# Altium schematic sheet KA2_2.SchDoc
size 420 x 297 mm; SheetNumber: 2; SheetTotal: 6
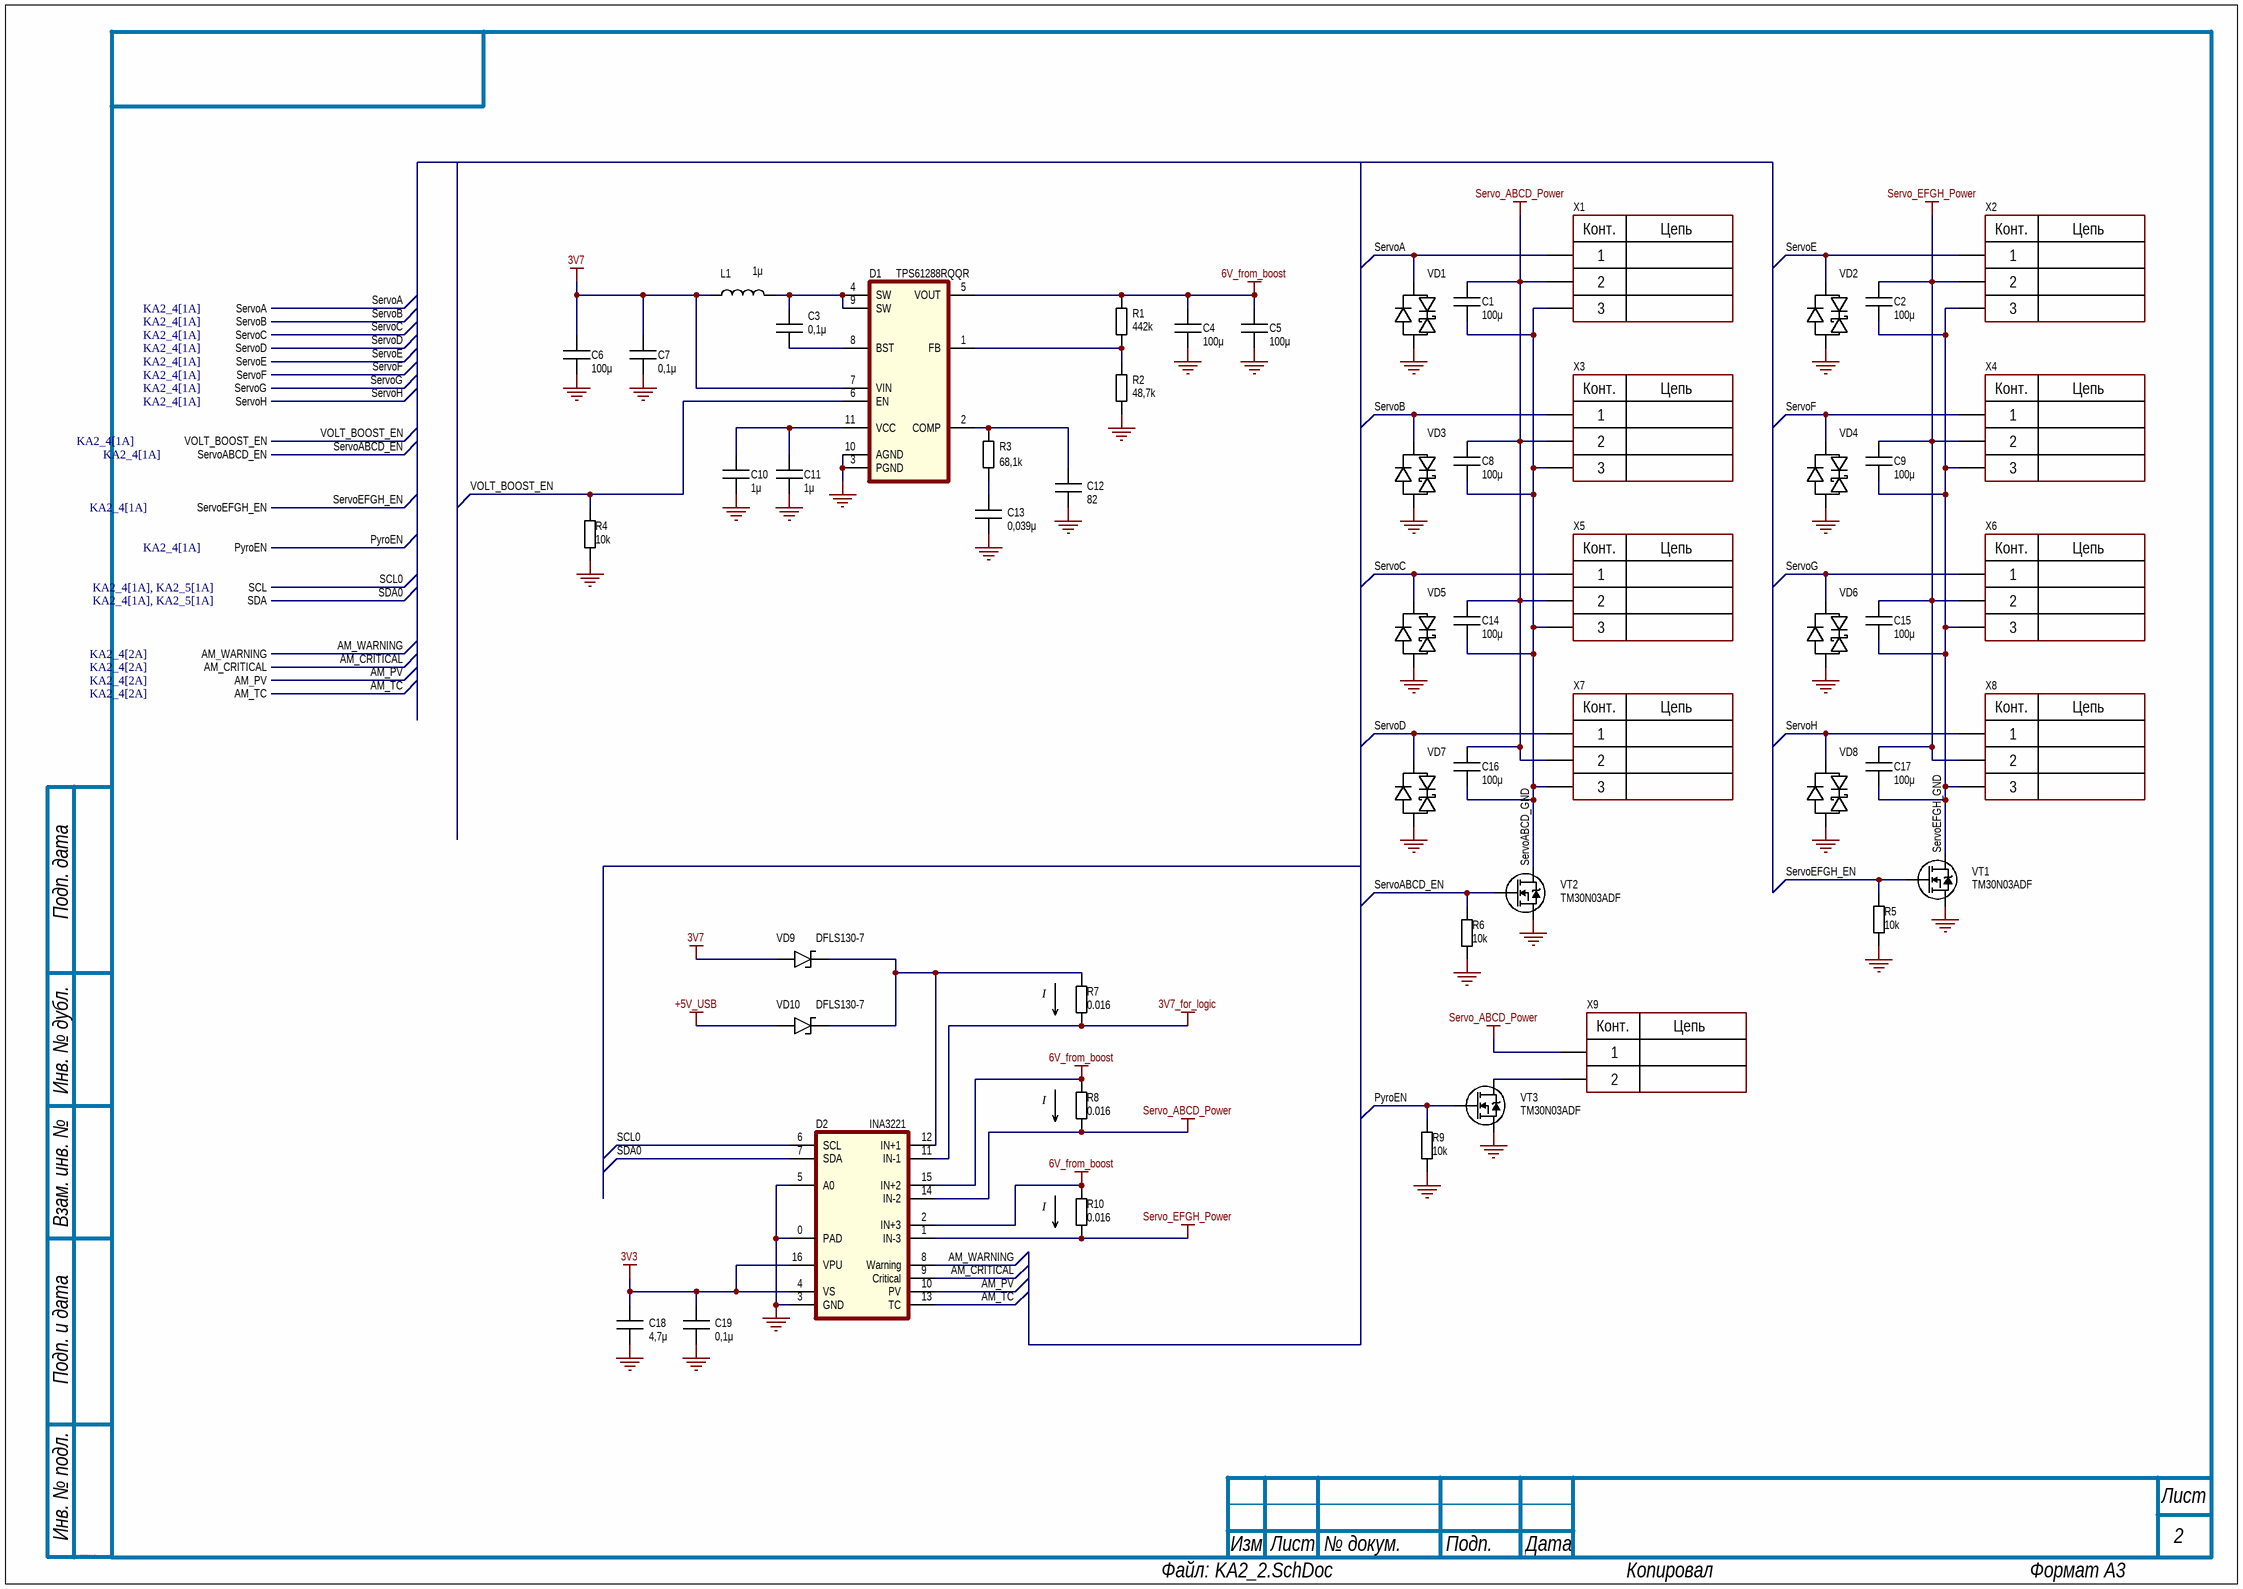
[diagram p0: KA2_2.SchDoc]

## Parts
C1  value 100μ  [Capacitor_1206]
C2  value 100μ  [Capacitor_1206]
C3  value 0,1μ  [Capacitor_0402]
C4  value 100μ  [Capacitor_1206]
C5  value 100μ  [Capacitor_1206]
C6  value 100μ  [Capacitor_1206]
C7  value 0,1μ  [Capacitor_0402]
C8  value 100μ  [Capacitor_1206]
C9  value 100μ  [Capacitor_1206]
C10  value 1μ  [Capacitor_0402]
C11  value 1μ  [Capacitor_0402]
C12  value 82  [Capacitor_0402]
C13  value 0,039μ  [Capacitor_0402]
C14  value 100μ  [Capacitor_1206]
C15  value 100μ  [Capacitor_1206]
C16  value 100μ  [Capacitor_1206]
C17  value 100μ  [Capacitor_1206]
C18  value 4,7μ  [Capacitor_0402]
C19  value 0,1μ  [Capacitor_0402]
D1  value TPS61288RQQR  [TPS61288]  (hidden comment: Boost Switching Regulator IC Adjustable 4.5V~18V 1 Output 15A VQFN-11-HR(2.5x3))
D2  INA3221  [QFN16_4x4mm]
L1  value 1μ  [Inductor_AWLU0730F-1R0MGA]  (hidden comment: 12A 1uH ±20% 7.4mΩ 15A Molded Inductor SMD,7x6.6mm Fixed Inductors RoHS)
R1  value 442k  [RES: 0402]
R2  value 48,7k  [RES: 0402]
R3  value 68,1k  [RES: 0402]
R4  value 10k  [RES: 0402]
R5  value 10k  [RES: 0402]
R6  value 10k  [RES: 0402]
R7  value 0.016  [RES: 1206]
R8  value 0.016  [RES: 1206]
R9  value 10k  [RES: 0402]
R10  value 0.016  [RES: 1206]
VD1  D1213A-01T  [SOD-523]  (value not drawn)
VD2  D1213A-01T  [SOD-523]  (value not drawn)
VD3  D1213A-01T  [SOD-523]  (value not drawn)
VD4  D1213A-01T  [SOD-523]  (value not drawn)
VD5  D1213A-01T  [SOD-523]  (value not drawn)
VD6  D1213A-01T  [SOD-523]  (value not drawn)
VD7  D1213A-01T  [SOD-523]  (value not drawn)
VD8  D1213A-01T  [SOD-523]  (value not drawn)
VD9  value DFLS130-7  [PowerDI-123]  (hidden comment: 1 Independent 30V 420mV@1A 1A PowerDI-123 Single Diodes RoHS)
VD10  value DFLS130-7  [PowerDI-123]  (hidden comment: 1 Independent 30V 420mV@1A 1A PowerDI-123 Single Diodes RoHS)
VT1  TM30N03ADF  [TM30N03ADF]
VT2  TM30N03ADF  [TM30N03ADF]
VT3  TM30N03ADF  [TM30N03ADF]
X1  Connector_JST_XH_B3B-XH-A_1x03_2.50mm  [CONN_JST_XH_B3B-XH-A_1x03_P2.50mm]  (value not drawn)  (no BOM)
X2  Connector_JST_XH_B3B-XH-A_1x03_2.50mm  [CONN_JST_XH_B3B-XH-A_1x03_P2.50mm]  (value not drawn)  (no BOM)
X3  Connector_JST_XH_B3B-XH-A_1x03_2.50mm  [CONN_JST_XH_B3B-XH-A_1x03_P2.50mm]  (value not drawn)  (no BOM)
X4  Connector_JST_XH_B3B-XH-A_1x03_2.50mm  [CONN_JST_XH_B3B-XH-A_1x03_P2.50mm]  (value not drawn)  (no BOM)
X5  Connector_JST_XH_B3B-XH-A_1x03_2.50mm  [CONN_JST_XH_B3B-XH-A_1x03_P2.50mm]  (value not drawn)  (no BOM)
X6  Connector_JST_XH_B3B-XH-A_1x03_2.50mm  [CONN_JST_XH_B3B-XH-A_1x03_P2.50mm]  (value not drawn)  (no BOM)
X7  Connector_JST_XH_B3B-XH-A_1x03_2.50mm  [CONN_JST_XH_B3B-XH-A_1x03_P2.50mm]  (value not drawn)  (no BOM)
X8  Connector_JST_XH_B3B-XH-A_1x03_2.50mm  [CONN_JST_XH_B3B-XH-A_1x03_P2.50mm]  (value not drawn)  (no BOM)
X9  Connector_JST_XH_B2B-XH-A_1x02_2.50mm  [CONN_JST_XH_B2B-XH-A_1x02_P2.50mm]  (value not drawn)  (no BOM)

## Ports
AM_CRITICAL (see KA2_4[2A]), AM_PV (see KA2_4[2A]), AM_TC (see KA2_4[2A]), AM_WARNING (see KA2_4[2A]), PyroEN (see KA2_4[1A]), SCL (see KA2_4[1A], KA2_5[1A]), SDA (see KA2_4[1A], KA2_5[1A]), ServoA (see KA2_4[1A]), ServoABCD_EN (see KA2_4[1A]), ServoB (see KA2_4[1A]), ServoC (see KA2_4[1A]), ServoD (see KA2_4[1A]), ServoE (see KA2_4[1A]), ServoEFGH_EN (see KA2_4[1A]), ServoF (see KA2_4[1A]), ServoG (see KA2_4[1A]), ServoH (see KA2_4[1A]), VOLT_BOOST_EN (see KA2_4[1A])

## Nets
3V3: C18.2 C19.2 D2.4(VS) D2.16(VPU)
3V7: C6.2 C7.2 D1.7(VIN) L1.2 VD9.A(Anode)
3V7_for_logic: D2.11(IN-1) R7.1
6V_from_boost: C4.2 C5.2 D1.5(VOUT) D2.2(IN+3) D2.15(IN+2) R1.2 R8.2 R10.2
+5V_USB: VD10.A(Anode)
GND: C4.1 C5.1 C6.1 C7.1 C10.1 C11.1 C12.1 C13.1 C18.1 C19.1 D1.3(PGND) D1.10(AGND) D2.0(PAD) D2.3(GND) D2.5(A0) R2.1 R4.1 R5.1 R6.1 R9.1 VD1.A VD2.A VD3.A VD4.A VD5.A VD6.A VD7.A VD8.A VT1.S VT2.S VT3.S
Servo_ABCD_Power: C1.2 C8.2 C14.2 C16.2 D2.14(IN-2) R8.1 X1.2 X3.2 X5.2 X7.2 X9.1
Servo_EFGH_Power: C2.2 C9.2 C15.2 C17.2 D2.1(IN-3) R10.1 X2.2 X4.2 X6.2 X8.2
AM_CRITICAL: D2.9(Critical) ; port AM_CRITICAL
AM_PV: D2.10(PV) ; port AM_PV
AM_TC: D2.13(TC) ; port AM_TC
AM_WARNING: D2.8(Warning) ; port AM_WARNING
PyroEN: R9.2 VT3.G ; port PyroEN
SCL0: D2.6(SCL) ; port SCL
SDA0: D2.7(SDA) ; port SDA
ServoA: VD1.K X1.1 ; port ServoA
ServoABCD_EN: R6.2 VT2.G ; port ServoABCD_EN
ServoABCD_GND: C1.1 C8.1 C14.1 C16.1 VT2.D X1.3 X3.3 X5.3 X7.3
ServoB: VD3.K X3.1 ; port ServoB
ServoC: VD5.K X5.1 ; port ServoC
ServoD: VD7.K X7.1 ; port ServoD
ServoE: VD2.K X2.1 ; port ServoE
ServoEFGH_EN: R5.2 VT1.G ; port ServoEFGH_EN
ServoEFGH_GND: C2.1 C9.1 C15.1 C17.1 VT1.D X2.3 X4.3 X6.3 X8.3
ServoF: VD4.K X4.1 ; port ServoF
ServoG: VD6.K X6.1 ; port ServoG
ServoH: VD8.K X8.1 ; port ServoH
VOLT_BOOST_EN: D1.6(EN) R4.2 ; port VOLT_BOOST_EN
NetC3_1: C3.1 D1.8(BST)
NetC3_2: C3.2 D1.4(SW) D1.9(SW) L1.1
NetC10_2: C10.2 C11.2 D1.11(VCC)
NetC12_2: C12.2 D1.2(COMP) R3.2
NetC13_2: C13.2 R3.1
NetD1_1: D1.1(FB) R1.1 R2.2
NetD2_12: D2.12(IN+1) R7.2 VD9.K(Kathode) VD10.K(Kathode)
NetVT3_D: VT3.D X9.2

## Notes on the sheet
- (near R7) I
- (near R8) I
- (near R10) I
- Подп. дата
- Инв. № дубл.
- Взам. инв. №
- Подп. и дата
- Инв. № подл.
- Изм.
- Лист
- № докум.
- Подп.
- Дата
- ALTIUM GOSTBOM2.0 KEV
- Файл:
- Копировал
- Формат А3
- (in symbol Connector_JST_XH_B2B-XH-A_1x02_2.50mm) Конт.; Цепь
- (in symbol Connector_JST_XH_B3B-XH-A_1x03_2.50mm) Конт.; Цепь

## Library data of the parts
C1 C2 C4-C6 C8 C9 C14-C17 = Ceramic_1206: ValueManufacturerPartNumber: Ceramic capacitor, 100μ, X7R, ±10%, 50V, 1206; TypeCapacitor: Ceramic capacitor; Tolerance: ±10%; TypeDielectric: X7R; Voltage: 50V; Manufacturer: *; HelpURL: *; Package: 1206; Mfr.Part: *
C3 C7 C19 = Ceramic_0402: ValueManufacturerPartNumber: Ceramic capacitor, 0,1μ, X7R, ±10%, 16V, 0402; TypeCapacitor: Ceramic capacitor; Tolerance: ±10%; TypeDielectric: X7R; Voltage: 16V; Manufacturer: *; HelpURL: *; Package: 0402; Mfr.Part: *
C10 C11 = Ceramic_0402: ValueManufacturerPartNumber: Ceramic capacitor, 1μ, X7R, ±10%, 16V, 0402; TypeCapacitor: Ceramic capacitor; Tolerance: ±10%; TypeDielectric: X7R; Voltage: 16V; Manufacturer: *; HelpURL: *; Package: 0402; Mfr.Part: *
C12 = Ceramic_0402: ValueManufacturerPartNumber: Ceramic capacitor, 82, X7R, ±10%, 16V, 0402; TypeCapacitor: Ceramic capacitor; Tolerance: ±10%; TypeDielectric: X7R; Voltage: 16V; Manufacturer: *; HelpURL: *; Package: 0402; Mfr.Part: *
C13 = Ceramic_0402: ValueManufacturerPartNumber: Ceramic capacitor, 0,039μ, X7R, ±10%, 16V, 0402; TypeCapacitor: Ceramic capacitor; Tolerance: ±10%; TypeDielectric: X7R; Voltage: 16V; Manufacturer: *; HelpURL: *; Package: 0402; Mfr.Part: *
C18 = Ceramic_0402: ValueManufacturerPartNumber: Ceramic capacitor, 4,7μ, X7R, ±10%, 16V, 0402; TypeCapacitor: Ceramic capacitor; Tolerance: ±10%; TypeDielectric: X7R; Voltage: 16V; Manufacturer: *; HelpURL: *; Package: 0402; Mfr.Part: *
D1 = TPS61288RQQR: Manufacturer: Texas Instruments; Mfr.Part: TPS61288RQQR; HelpURL: https://www.lcsc.com/product-image/C5219223.html
D2 = INA3221: Микросхема трехканального амперметра-вольтметра; Manufacturer: Texas Instruments; Mfr.Part: INA3221AIRGVR; Value: INA3221; HelpURL: https://www.lcsc.com/product-detail/C181255.html
L1 = Inductor_AWLU0730F-1R0MGA: 17A 1uH ±20% 3.8mΩ 21A Molded Inductor SMD,7.2x7mm Fixed Inductors RoHS; Manufacturer: APV; Mfr.Part: AWLU0730F-1R0MGA; HelpURL: https://www.lcsc.com/product-detail/C54123597.html
R1 = Resistor_0402: ValueManufacturerPartNumber: Resistor, 442k, ±1%, 0402; Tolerance: ±1%; Manufacturer: *; Package: 0402; Mfr.Part: *; TypeResistor: Resistor; HelpURL: *
R2 = Resistor_0402: ValueManufacturerPartNumber: Resistor, 48,7k, ±1%, 0402; Tolerance: ±1%; Manufacturer: *; Package: 0402; Mfr.Part: *; TypeResistor: Resistor; HelpURL: *
R3 = Resistor_0402: ValueManufacturerPartNumber: Resistor, 68,1k, ±1%, 0402; Tolerance: ±1%; Manufacturer: *; Package: 0402; Mfr.Part: *; TypeResistor: Resistor; HelpURL: *
R4-R6 R9 = Resistor_0402: ValueManufacturerPartNumber: Resistor, 10k, ±1%, 0402; Tolerance: ±1%; Manufacturer: *; Package: 0402; Mfr.Part: *; TypeResistor: Resistor; HelpURL: *
R7 R8 R10 = Resistor_1206: ValueManufacturerPartNumber: Resistor, 0.016, ±1%, 1206; Tolerance: ±1%; Manufacturer: *; Package: 1206; HelpURL: *; TypeResistor: Resistor; Mfr.Part: *
VD1-VD8 = D1213A-01T: Manufacturer: Diodes; Mfr.Part: D1213A-01T-7; Value: D1213A-01T-7; HelpURL: https://www.lcsc.com/product-detail/C460584.html
VD9 VD10 = Diode_DFLS130-7: Диод Шоттки 30V 420mV@1A 1A PowerDI-123; Mfr.Part: DFLS130-7; Manufacturer: DIODES; HelpURL: https://www.lcsc.com/product-detail/C150474.html
VT1-VT3 = TM30N03ADF: Транзистор N-канальный, 30В 30А 15Вт, DFN3x3-8; Manufacturer: Tritech-MOS; Mfr.Part: TM30N03ADF; Value: TM30N03ADF; HelpURL: https://www.lcsc.com/product-detail/C7422839.html
X1-X8 = Connector_JST_XH_B3B-XH-A_1x03_2.50mm: 3-pin through-hole connector
X9 = Connector_JST_XH_B2B-XH-A_1x02_2.50mm: 2-pin through-hole connector